# Altium schematic sheet TopLevelSchem.SchDoc
size Letter; DrawnBy: Adam Gilbert; Organization: Altium Limited; Address1: L3, 12a Rodborough Rd; Address2: Frenchs Forest; Address3: NSW; Address4: Australia 2086; DocumentNumber: 1; SheetNumber: 1; SheetTotal: 4
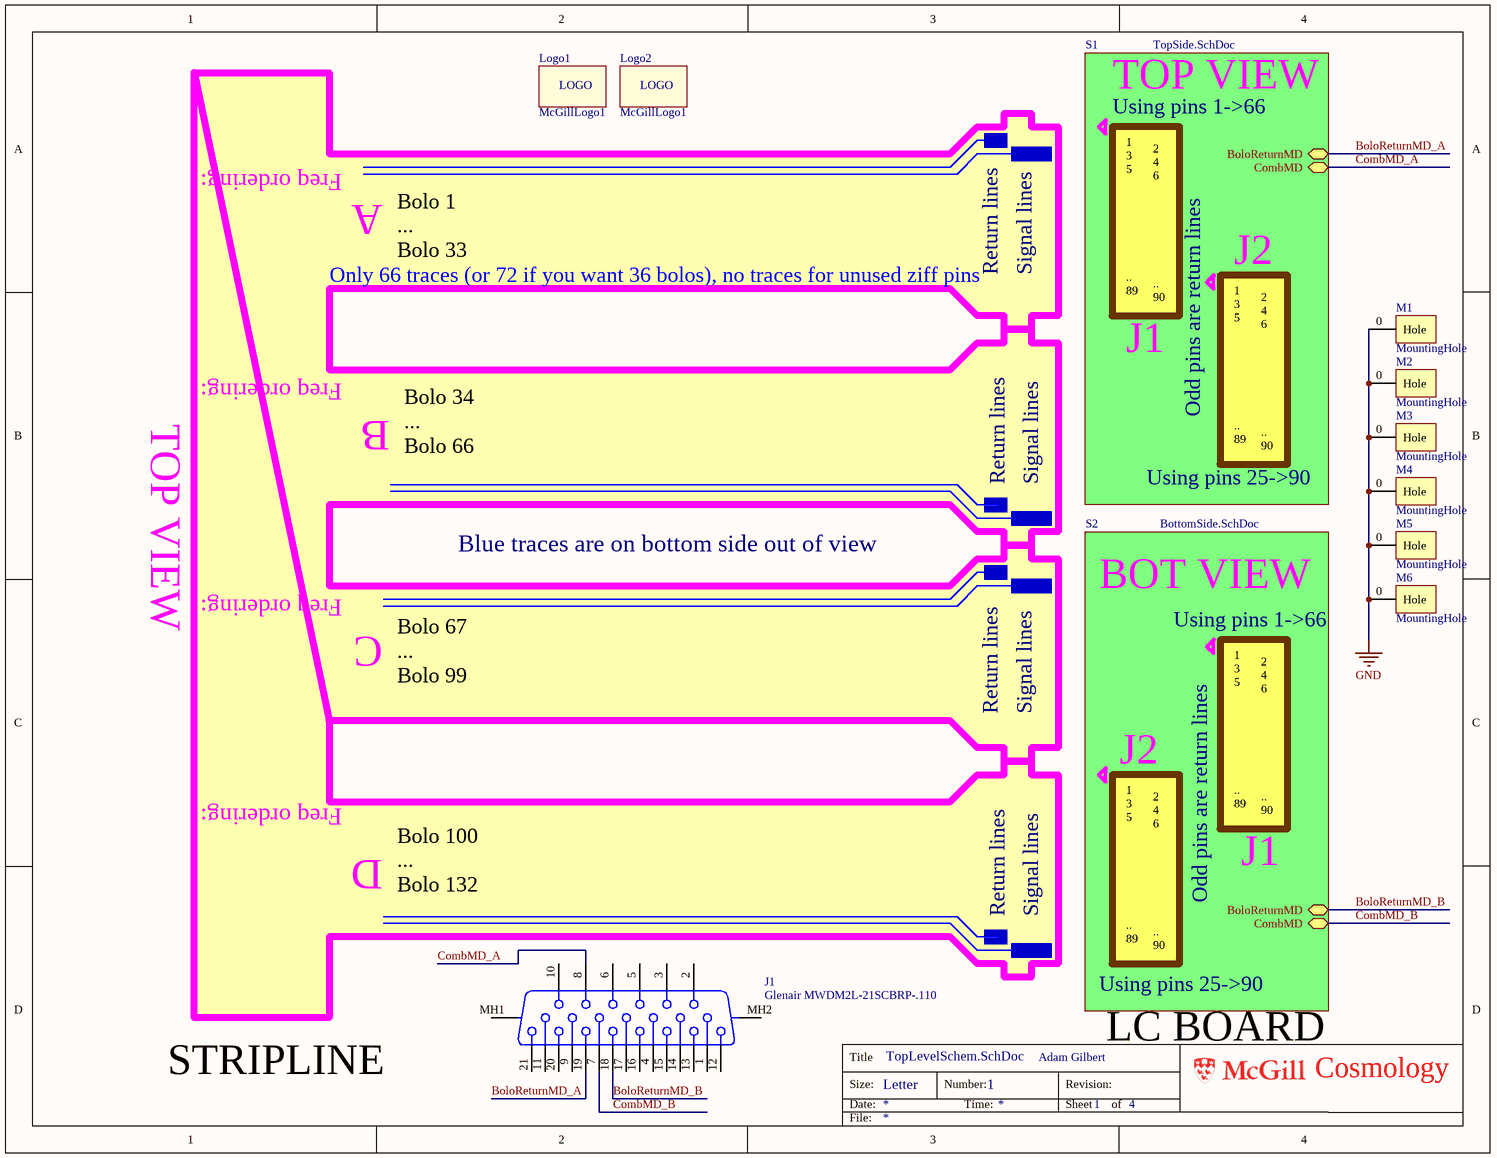
[diagram p0: TopLevelSchem.SchDoc]

## Parts
J1  Glenair MWDM2L-21SCBRP-.110  [MWDM2L-21SCBRP-.110]
Logo1  McGillLogo1  [McGillLogo1]  (no BOM)
Logo2  McGillLogo1  [McGillLogo1]  (no BOM)
M1  MountingHole  [MountingHole]
M2  MountingHole  [MountingHole]
M3  MountingHole  [MountingHole]
M4  MountingHole  [MountingHole]
M5  MountingHole  [MountingHole]
M6  MountingHole  [MountingHole]

## Sub-sheets
S1 = TopSide.SchDoc: BoloReturnMD, CombMD
S2 = BottomSide.SchDoc: BoloReturnMD, CombMD

## Nets
GND: M1.0(Hole) M2.0(Hole) M3.0(Hole) M4.0(Hole) M5.0(Hole) M6.0(Hole)
BoloReturnMD_A: J1.19 ; sheet S1/BoloReturnMD
BoloReturnMD_B: J1.18 ; sheet S2/BoloReturnMD
CombMD_A: J1.8 ; sheet S1/CombMD
CombMD_B: J1.7 ; sheet S2/CombMD

Not connected (* = marked no-connect by the designer): J1 1 2 3 4 5 6 9 10 11 12 13 14 15 16 17 20 21 MH1 MH2

## Notes on the sheet
- TOP VIEW
- Freq ordering:
- Using pins 1->66
- A
- Only 66 traces (or 72 if you want 36 bolos), no traces for unused ziff pins
- Bolo 1
  ...
  Bolo 33
- Return lines
- Signal lines
- J2
- 1
  3
  5
  ..
  89
- J1
- 2
  4
  6
  ..
  90
- B
- Odd pins are return lines
- Bolo 34
  ...
  Bolo 66
- Using pins 25->90
- Blue traces are on bottom side out of view
- C
- BOT VIEW
- (near M6) Using pins 1->66
- Bolo 67
  ...
  Bolo 99
- D
- Bolo 100
  ...
  Bolo 132
- LC BOARD
- STRIPLINE
- Title
- Size:
- Date:
- Letter
- Number:
- Time:
- Revision:
- Sheet
- of
- Cosmology
- File:
- (in symbol Logo) LOGO

## Library data of the parts
J1 = MWDM2L-21SCBRP-.110: Glenair 21pin RA Micro Dsub socket - MWDM2L-21SCBRP-.110; PackageDescription: Connector; D-Sub, Thru-Hole; 9 Position; Vertical; Body 30.81 x 9.60 x 8.20 mm (LxWxH)
Logo1 Logo2 = Logo